# Altium schematic sheet sensor.SchDoc
size A4
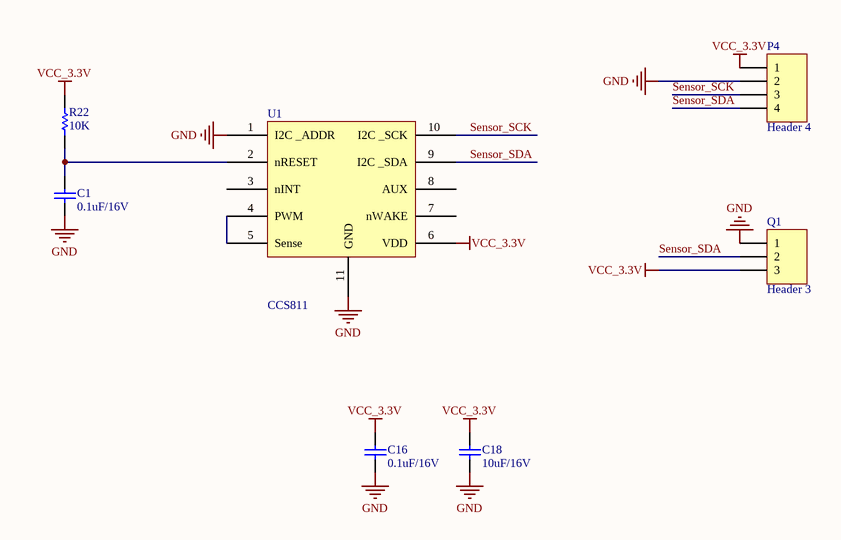
[diagram p0: sensor.SchDoc]

## Parts
C1  0.1uF/16V  [0603C]
C16  0.1uF/16V  [0603C]
C18  10uF/16V  [0603C]
P4  Header 4  [4-2.5MM-W]
Q1  Header 3  [TO-92]
R22  10K  [0603R]
U1  CCS811  [QFN60P270X400X80-10N]

## Nets
GND: C1.2 C16.2 C18.2 P4.2 Q1.1 U1.1(I2C__ADDR) U1.11(GND)
VCC_3.3V: C16.1 C18.1 P4.1 Q1.3 R22.2 U1.6(VDD)
Sensor_SCK: P4.3 U1.10(I2C__SCK)
Sensor_SDA: P4.4 Q1.2 U1.9(I2C__SDA)
NetC1_1: C1.1 R22.1 U1.2(nRESET)
NetU1_4: U1.4(PWM) U1.5(Sense)

Not connected (* = marked no-connect by the designer): U1 3(nINT) 7(nWAKE) 8(AUX)

## Library data of the parts
C1 C16 C18 = Cap: Capacitor; Value: 2.2uF/6.3V; Published: 8-Jun-2000; LatestRevisionDate: 17-Jul-2002; LatestRevisionNote: Re-released for DXP Platform.; PackageReference: RAD-0.3; Publisher: Altium Limited
P4 = Header 4: Header, 4-Pin; LatestRevisionDate: 17-Jul-2002; LatestRevisionNote: Re-released for DXP Platform.; Publisher: Altium Limited
Q1 = Header 3: Header, 3-Pin; LatestRevisionDate: 17-Jul-2002; LatestRevisionNote: Re-released for DXP Platform.; Publisher: Altium Limited
R22 = Res1: Resistor; Value: 1K; Published: 8-Jun-2000; LatestRevisionDate: 17-Jul-2002; LatestRevisionNote: Re-released for DXP Platform.; PackageReference: AXIAL-0.3; Publisher: Altium Limited